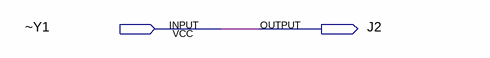
[diagram p0: schematic sheet]
// Quartus schematic J2.bdf as structural Verilog: 0 symbols, 2 pins
module J2 (
  input  \~Y1 ,
  output J2
);


  assign J2 = \~Y1 ;
endmodule
